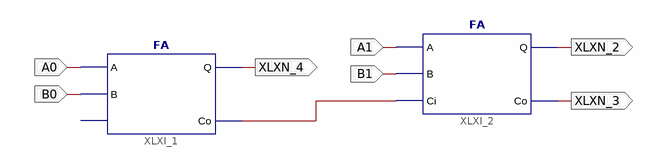
[diagram p0: schematic sheet 1]
// Xilinx ISE schematic addr2b.sch (spartan3e) as structural Verilog: 2 symbols, 7 ports
module addr2b (
  input  A0,
  input  B0,
  input  A1,
  input  B1,
  output XLXN_2,
  output XLXN_3,
  output XLXN_4
);

  wire XLXN_1;

  FA XLXI_1 (.A(A0), .B(B0), .Q(XLXN_4), .Co(XLXN_1));  // open: Ci
  FA XLXI_2 (.A(A1), .B(B1), .Ci(XLXN_1), .Q(XLXN_2), .Co(XLXN_3));
endmodule
